# Altium project LimeSDR-X3_1v0.PrjPcb (part 18 of 19)

## Sheet 31_Power2.SchDoc: Board power supply 2
size A3; Organization: Lime Microsystems; Address1: Surrey Tech Centre; Address2: Guildford GU2 7YG; Address3: Surrey; Address4: United Kingdom; Revision: v1.0; SheetNumber: 31; SheetTotal: 31
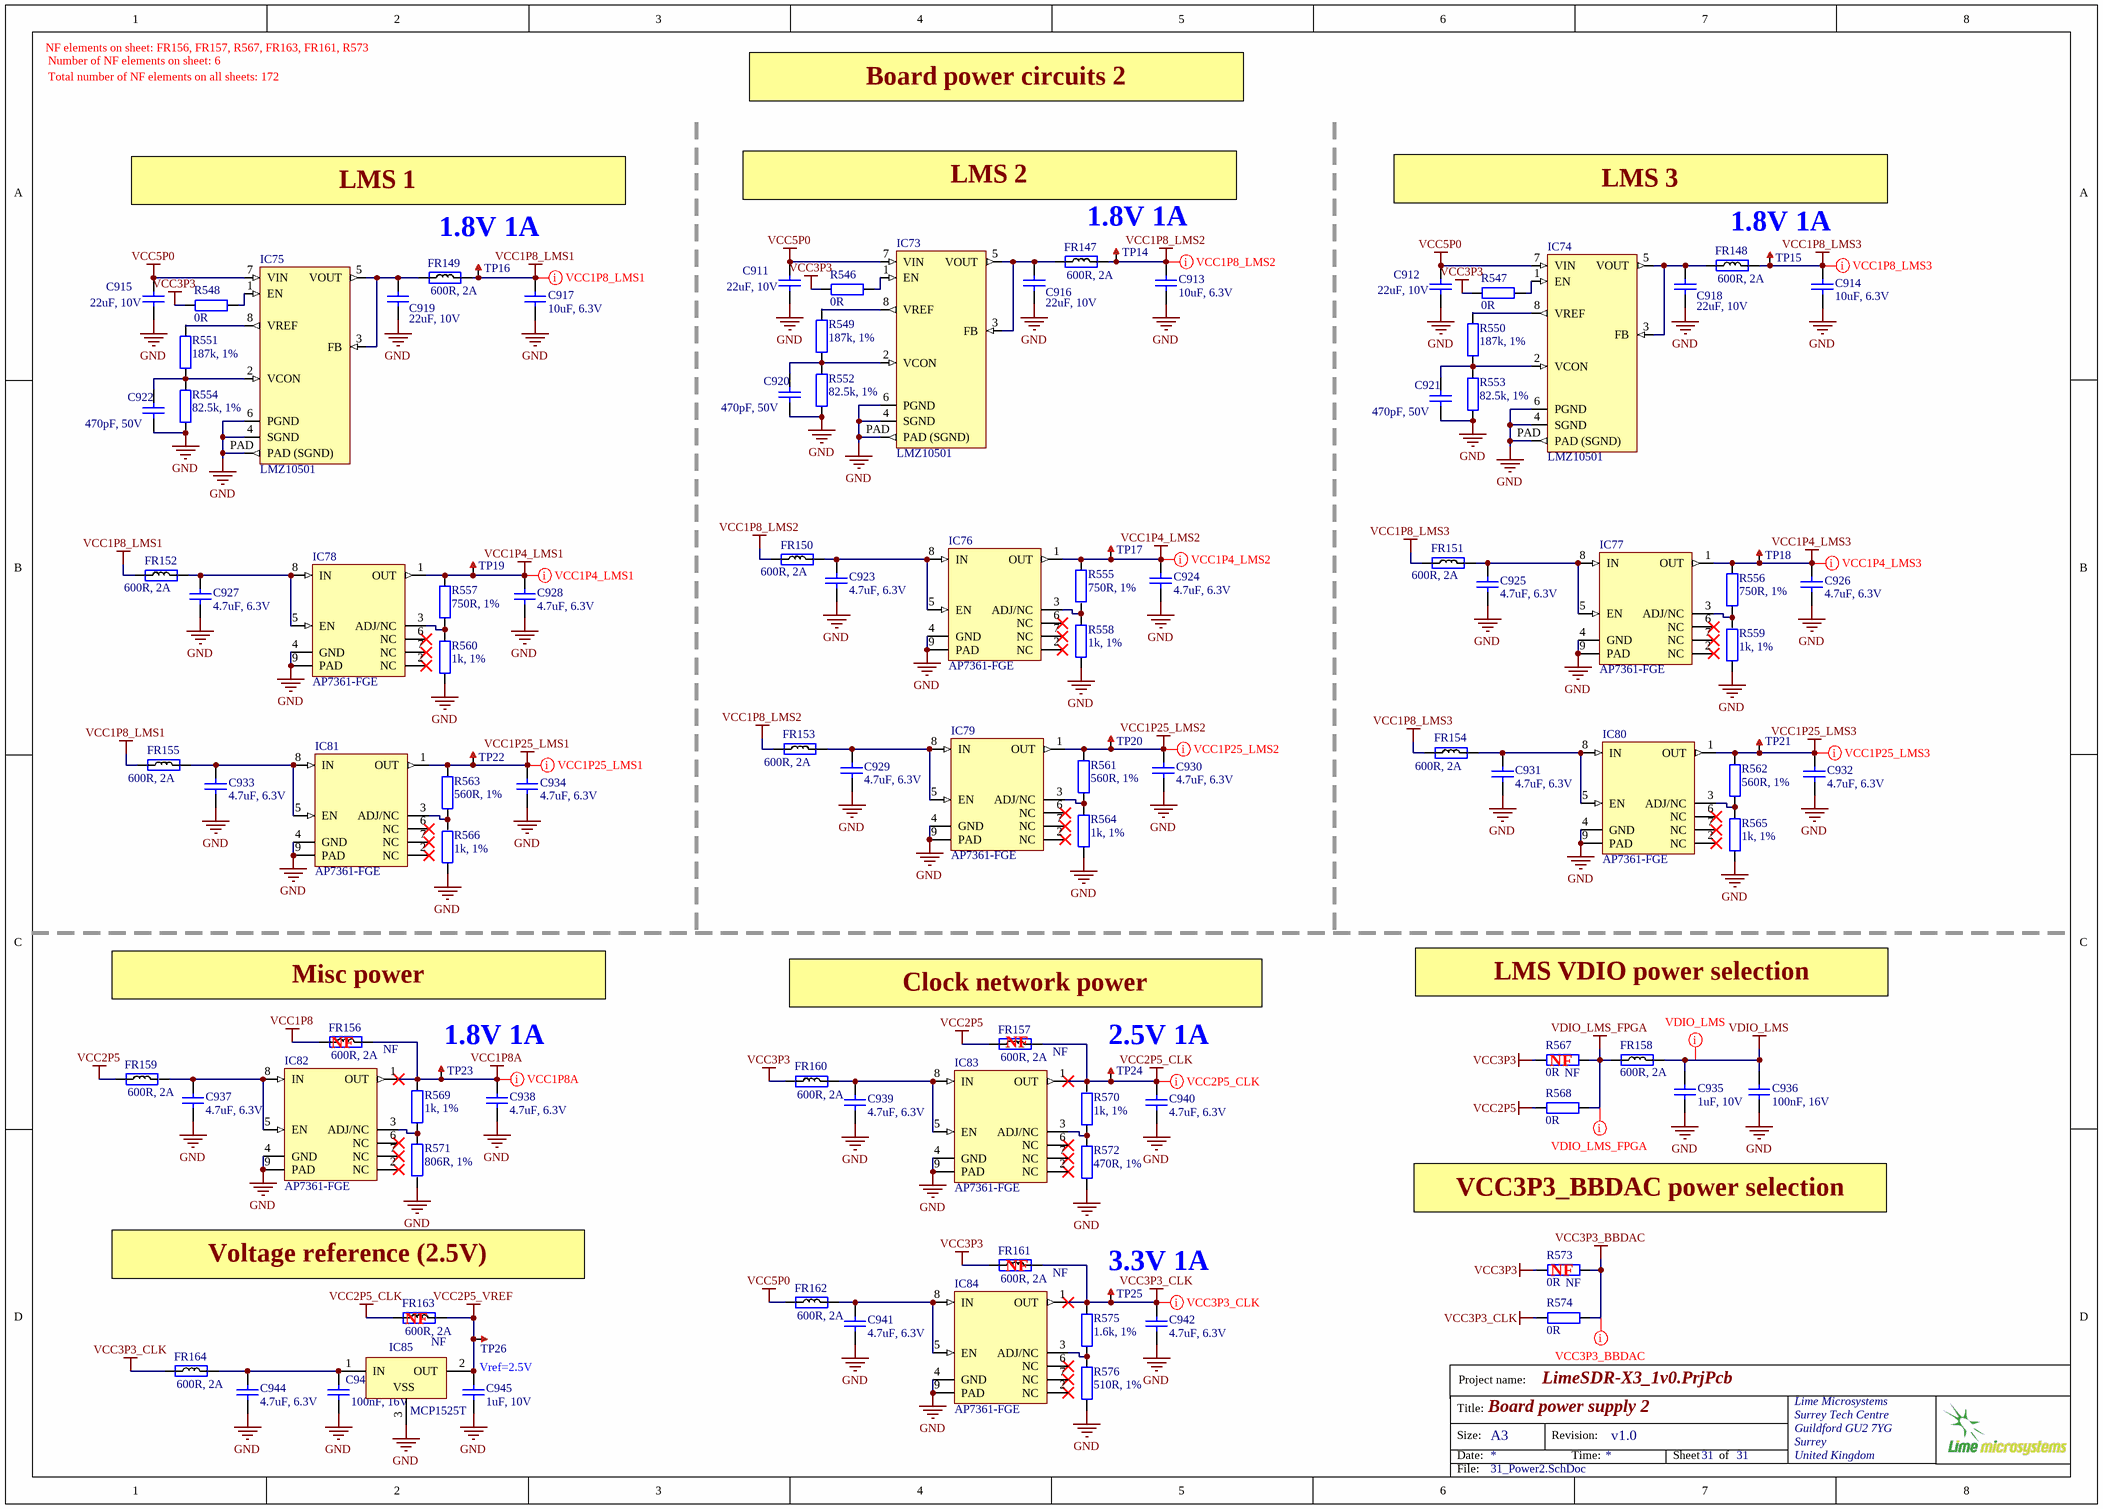
[diagram p30: 31_Power2.SchDoc]

### Parts
C911  22uF, 10V  [CAP0603]
C912  22uF, 10V  [CAP0603]
C913  10uF, 6.3V  [CAP0603]
C914  10uF, 6.3V  [CAP0603]
C915  22uF, 10V  [CAP0603]
C916  22uF, 10V  [CAP0603]
C917  10uF, 6.3V  [CAP0603]
C918  22uF, 10V  [CAP0603]
C919  22uF, 10V  [CAP0603]
C920  470pF, 50V  [CAP0402]
C921  470pF, 50V  [CAP0402]
C922  470pF, 50V  [CAP0402]
C923  4.7uF, 6.3V  [CAP0402]
C924  4.7uF, 6.3V  [CAP0402]
C925  4.7uF, 6.3V  [CAP0402]
C926  4.7uF, 6.3V  [CAP0402]
C927  4.7uF, 6.3V  [CAP0402]
C928  4.7uF, 6.3V  [CAP0402]
C929  4.7uF, 6.3V  [CAP0402]
C930  4.7uF, 6.3V  [CAP0402]
C931  4.7uF, 6.3V  [CAP0402]
C932  4.7uF, 6.3V  [CAP0402]
C933  4.7uF, 6.3V  [CAP0402]
C934  4.7uF, 6.3V  [CAP0402]
C935  1uF, 10V  [CAP0402]
C936  100nF, 16V  [CAP0402]
C937  4.7uF, 6.3V  [CAP0402]
C938  4.7uF, 6.3V  [CAP0402]
C939  4.7uF, 6.3V  [CAP0402]
C940  4.7uF, 6.3V  [CAP0402]
C941  4.7uF, 6.3V  [CAP0402]
C942  4.7uF, 6.3V  [CAP0402]
C943  100nF, 16V  [CAP0402]
C944  4.7uF, 6.3V  [CAP0402]
C945  1uF, 10V  [CAP0402]
FR147  600R, 2A  [RES0805]
FR148  600R, 2A  [RES0805]
FR149  600R, 2A  [RES0805]
FR150  600R, 2A  [RES0805]
FR151  600R, 2A  [RES0805]
FR152  600R, 2A  [RES0805]
FR153  600R, 2A  [RES0805]
FR154  600R, 2A  [RES0805]
FR155  600R, 2A  [RES0805]
FR156  600R, 2A  Assembly Info: NF  [RES0805]
FR157  600R, 2A  Assembly Info: NF  [RES0805]
FR158  600R, 2A  [RES0805]
FR159  600R, 2A  [RES0805]
FR160  600R, 2A  [RES0805]
FR161  600R, 2A  Assembly Info: NF  [RES0805]
FR162  600R, 2A  [RES0805]
FR163  600R, 2A  Assembly Info: NF  [RES0805]
FR164  600R, 2A  [RES0805]
IC73  LMZ10501  [LMZ10501]
IC74  LMZ10501  [LMZ10501]
IC75  LMZ10501  [LMZ10501]
IC76  AP7361-FGE  [AP7361]
IC77  AP7361-FGE  [AP7361]
IC78  AP7361-FGE  [AP7361]
IC79  AP7361-FGE  [AP7361]
IC80  AP7361-FGE  [AP7361]
IC81  AP7361-FGE  [AP7361]
IC82  AP7361-FGE  [AP7361]
IC83  AP7361-FGE  [AP7361]
IC84  AP7361-FGE  [AP7361]
IC85  MCP1525T  [SOT23-3_v2]
R546  0R  [RES0402]
R547  0R  [RES0402]
R548  0R  [RES0402]
R549  187k, 1%  [RES0402]
R550  187k, 1%  [RES0402]
R551  187k, 1%  [RES0402]
R552  82.5k, 1%  [RES0402]
R553  82.5k, 1%  [RES0402]
R554  82.5k, 1%  [RES0402]
R555  750R, 1%  [RES0402]
R556  750R, 1%  [RES0402]
R557  750R, 1%  [RES0402]
R558  1k, 1%  [RES0402]
R559  1k, 1%  [RES0402]
R560  1k, 1%  [RES0402]
R561  560R, 1%  [RES0402]
R562  560R, 1%  [RES0402]
R563  560R, 1%  [RES0402]
R564  1k, 1%  [RES0402]
R565  1k, 1%  [RES0402]
R566  1k, 1%  [RES0402]
R567  0R  Assembly Info: NF  [RES0402]
R568  0R  [RES0402]
R569  1k, 1%  [RES0402]
R570  1k, 1%  [RES0402]
R571  806R, 1%  [RES0402]
R572  470R, 1%  [RES0402]
R573  0R  Assembly Info: NF  [RES0402]
R574  0R  [RES0402]
R575  1.6k, 1%  [RES0402]
R576  510R, 1%  [RES0402]
TP14  TESTPOINT_PAD  [TP_PAD_1p5MM]  (value not drawn)  (no BOM)
TP15  TESTPOINT_PAD  [TP_PAD_1p5MM]  (value not drawn)  (no BOM)
TP16  TESTPOINT_PAD  [TP_PAD_1p5MM]  (value not drawn)  (no BOM)
TP17  TESTPOINT_PAD  [TP_PAD_1p5MM]  (value not drawn)  (no BOM)
TP18  TESTPOINT_PAD  [TP_PAD_1p5MM]  (value not drawn)  (no BOM)
TP19  TESTPOINT_PAD  [TP_PAD_1p5MM]  (value not drawn)  (no BOM)
TP20  TESTPOINT_PAD  [TP_PAD_1p5MM]  (value not drawn)  (no BOM)
TP21  TESTPOINT_PAD  [TP_PAD_1p5MM]  (value not drawn)  (no BOM)
TP22  TESTPOINT_PAD  [TP_PAD_1p5MM]  (value not drawn)  (no BOM)
TP23  TESTPOINT_PAD  [TP_PAD_1p5MM]  (value not drawn)  (no BOM)
TP24  TESTPOINT_PAD  [TP_PAD_1p5MM]  (value not drawn)  (no BOM)
TP25  TESTPOINT_PAD  [TP_PAD_1p5MM]  (value not drawn)  (no BOM)
TP26  TESTPOINT_PAD  [TP_PAD_1p5MM]  (value not drawn)  (no BOM)

### Nets
GND: C911.1 C912.1 C913.1 C914.1 C915.1 C916.1 C917.1 C918.1 C919.1 C920.2 C921.2 C922.2 C923.1 C924.1 C925.1 C926.1 C927.1 C928.1 C929.1 C930.1 C931.1 C932.1 C933.1 C934.1 C935.1 C936.2 C937.1 C938.1 C939.1 C940.1 C941.1 C942.1 C943.1 C944.1 C945.1 IC73.4(SGND) IC73.6(PGND) IC73.PAD(PAD_(SGND)) IC74.4(SGND) IC74.6(PGND) IC74.PAD(PAD_(SGND)) IC75.4(SGND) IC75.6(PGND) IC75.PAD(PAD_(SGND)) IC76.4(GND) IC76.9(PAD) IC77.4(GND) IC77.9(PAD) IC78.4(GND) IC78.9(PAD) IC79.4(GND) IC79.9(PAD) IC80.4(GND) IC80.9(PAD) IC81.4(GND) IC81.9(PAD) IC82.4(GND) IC82.9(PAD) IC83.4(GND) IC83.9(PAD) IC84.4(GND) IC84.9(PAD) IC85.3(VSS) R552.1 R553.1 R554.1 R558.1 R559.1 R560.1 R564.1 R565.1 R566.1 R571.2 R572.2 R576.2
VCC1P4_LMS1: C928.2 IC78.1(OUT) R557.1 TP19.1
VCC1P4_LMS2: C924.2 IC76.1(OUT) R555.1 TP17.1
VCC1P4_LMS3: C926.2 IC77.1(OUT) R556.1 TP18.1
VCC1P8: FR156.1
VCC1P8_LMS1: C917.2 FR149.2 FR152.1 FR155.1 TP16.1
VCC1P8_LMS2: C913.2 FR147.2 FR150.1 FR153.1 TP14.1
VCC1P8_LMS3: C914.2 FR148.2 FR151.1 FR154.1 TP15.1
VCC1P8A: C938.2 FR156.2 IC82.1(OUT) R569.2 TP23.1
VCC1P25_LMS1: C934.2 IC81.1(OUT) R563.2 TP22.1
VCC1P25_LMS2: C930.2 IC79.1(OUT) R561.2 TP20.1
VCC1P25_LMS3: C932.2 IC80.1(OUT) R562.2 TP21.1
VCC2P5: FR157.1 FR159.1 R568.2
VCC2P5_CLK: C940.2 FR157.2 FR163.1 IC83.1(OUT) R570.2 TP24.1
VCC2P5_VREF: C945.2 FR163.2 IC85.2(OUT) TP26.1
VCC3P3: FR160.1 FR161.1 R546.1 R547.1 R548.1 R567.2 R573.2
VCC3P3_BBDAC: R573.1 R574.1
VCC3P3_CLK: C942.2 FR161.2 FR164.1 IC84.1(OUT) R574.2 R575.2 TP25.1
VCC5P0: C911.2 C912.2 C915.2 FR162.1 IC73.7(VIN) IC74.7(VIN) IC75.7(VIN)
VDIO_LMS: C935.2 C936.1 FR158.2
VDIO_LMS_FPGA: FR158.1 R567.1 R568.1
NetC916_2: C916.2 FR147.1 IC73.3(FB) IC73.5(VOUT)
NetC918_2: C918.2 FR148.1 IC74.3(FB) IC74.5(VOUT)
NetC919_2: C919.2 FR149.1 IC75.3(FB) IC75.5(VOUT)
NetC920_1: C920.1 IC73.2(VCON) R549.1 R552.2
NetC921_1: C921.1 IC74.2(VCON) R550.1 R553.2
NetC922_1: C922.1 IC75.2(VCON) R551.1 R554.2
NetC923_2: C923.2 FR150.2 IC76.5(EN) IC76.8(IN)
NetC925_2: C925.2 FR151.2 IC77.5(EN) IC77.8(IN)
NetC927_2: C927.2 FR152.2 IC78.5(EN) IC78.8(IN)
NetC929_2: C929.2 FR153.2 IC79.5(EN) IC79.8(IN)
NetC931_2: C931.2 FR154.2 IC80.5(EN) IC80.8(IN)
NetC933_2: C933.2 FR155.2 IC81.5(EN) IC81.8(IN)
NetC937_2: C937.2 FR159.2 IC82.5(EN) IC82.8(IN)
NetC939_2: C939.2 FR160.2 IC83.5(EN) IC83.8(IN)
NetC941_2: C941.2 FR162.2 IC84.5(EN) IC84.8(IN)
NetC943_2: C943.2 C944.2 FR164.2 IC85.1(IN)
NetIC73_1: IC73.1(EN) R546.2
NetIC73_8: IC73.8(VREF) R549.2
NetIC74_1: IC74.1(EN) R547.2
NetIC74_8: IC74.8(VREF) R550.2
NetIC75_1: IC75.1(EN) R548.2
NetIC75_8: IC75.8(VREF) R551.2
NetIC76_3: IC76.3(ADJ/NC) R555.2 R558.2
NetIC77_3: IC77.3(ADJ/NC) R556.2 R559.2
NetIC78_3: IC78.3(ADJ/NC) R557.2 R560.2
NetIC79_3: IC79.3(ADJ/NC) R561.1 R564.2
NetIC80_3: IC80.3(ADJ/NC) R562.1 R565.2
NetIC81_3: IC81.3(ADJ/NC) R563.1 R566.2
NetIC82_3: IC82.3(ADJ/NC) R569.1 R571.1
NetIC83_3: IC83.3(ADJ/NC) R570.1 R572.1
NetIC84_3: IC84.3(ADJ/NC) R575.1 R576.1

Not connected (* = marked no-connect by the designer): IC76 2(NC)* 6(NC)* 7(NC)*; IC77 2(NC)* 6(NC)* 7(NC)*; IC78 2(NC)* 6(NC)* 7(NC)*; IC79 2(NC)* 6(NC)* 7(NC)*; IC80 2(NC)* 6(NC)* 7(NC)*; IC81 2(NC)* 6(NC)* 7(NC)*; IC82 2(NC)* 6(NC)* 7(NC)*; IC83 2(NC)* 6(NC)* 7(NC)*; IC84 2(NC)* 6(NC)* 7(NC)*

### Layout directives
net class VCC1P8_LMS1: VCC1P8_LMS1
net class VCC1P4_LMS1: VCC1P4_LMS1
net class VCC1P25_LMS1: VCC1P25_LMS1
net class VCC1P8_LMS2: VCC1P8_LMS2
net class VCC1P4_LMS2: VCC1P4_LMS2
net class VCC1P25_LMS2: VCC1P25_LMS2
net class VDIO_LMS: VDIO_LMS
net class VDIO_LMS_FPGA: VDIO_LMS_FPGA
net class VCC1P8_LMS3: VCC1P8_LMS3
net class VCC1P4_LMS3: VCC1P4_LMS3
net class VCC1P25_LMS3: VCC1P25_LMS3
net class VCC1P8A: VCC1P8A
net class VCC3P3_CLK: VCC3P3_CLK
net class VCC2P5_CLK: VCC2P5_CLK
net class VCC3P3_BBDAC: VCC3P3_BBDAC

### Notes on the sheet
- NF elements on sheet: FR156, FR157, R567, FR163, FR161, R573
- Number of NF elements on sheet: 6
- Total number of NF elements on all sheets: 172
- Board power circuits 2
- LMS 1
- 1.8V 1A
- LMS 2
- (near TP14) 1.8V 1A
- LMS 3
- (near TP15) 1.8V 1A
- LMS VDIO power selection
- Misc power
- (near FR156) NF
- (near TP23) 1.8V 1A
- (near FR157) Clock network power
- (near FR157) NF
- (near TP24) 2.5V 1A
- (near R567) NF
- VCC3P3_BBDAC power selection
- Voltage reference (2.5V)
- (near FR163) NF
- (near FR161) NF
- (near TP25) 3.3V 1A
- (near R573) NF
- (near C945) Vref=2.5V
- Project name:
- Title:
- Size:
- Date:
- A3
- Revision:
- Time:
- Sheet
- of
- File:

### Library data of the parts
C911 C912 C915 C916 C918 C919 = Cap_0603: Manufacturer Part Number 1: C1608X5R1A226M080AC; Manufacturer: TDK Corporation; Part Description: 22µF ±20% 10V Ceramic Capacitor X5R 0603 (1608 Metric); Brand: TDK; Temperature Coefficient / Code: +/- 15 %; Tolerance: 20 %; Type: Multilayer Ceramic Chip Capacitor; Supplier 1: Mouser; Supplier Part Number 1: 810-C1608X5R1A226M; Package / Case: 0603 (1608 metric); Category: Multilayer Ceramic Capacitors MLCC - SMD/SMT; Capacitance: 22 uF; Operating Temperature Range: - 55 C to + 85 C; Case Code - in: 0603; Voltage Rating DC: 10 V; Case Code - mm: 1608; Value: 22uF, 10V
C913 C914 C917 = Cap_0603: as C803 on sheet 29_Clocks2; Supplier 1: Digi-Key; Supplier Part Number 1: 311-1448-2-ND; Package / Case: 0603 (1608 Metric); Category: Capacitors; Voltage - Rated: 6.3V; Value: 10uF, 6.3V
C920-C922 = Cap_0402: Manufacturer Part Number 1: C1005C0G1H471J050BA; Manufacturer: TDK Corporation; Part Description: 470pF ±5% 50V Ceramic Capacitor C0G, NP0 0402 (1005 Metric); Tolerance: ±5%; Temperature Coefficient: C0G, NP0; Value: 470pF, 50V; Supplier 1: Digi-Key; Supplier Part Number 1: 445-2656-6-ND; Ratings: -; Package / Case: 0402 (1005 Metric); Capacitance: 470pF; Packaging: Digi-Reel®; RoHS: RoHS Compliant; Lead Style: -; Thickness (Max): 0.022" (0.55mm); Size / Dimension: 0.039" L x 0.020" W (1.00mm x 0.50mm); Lead Spacing: -; Operating Temperature: -55°C ~ 125°C; Height - Seated (Max): -; Applications: General Purpose; Mounting Type: Surface Mount, MLCC; Voltage - Rated: 50V; Category: Capacitors; Features: -; Manufacturer Part Number: C1005C0G1H471J050BA
C923-C934 C939-C942 = Cap_0402: as C891 on sheet 30_Power1; Lead Style: -; Ratings: -; Height - Seated (Max): -; Thickness (Max): 0.022" (0.55mm); Voltage - Rated: 6.3V; Packaging: Cut Tape (CT); Lead Spacing: -; Category: Capacitors; Supplier Part Number 1: 490-5408-1-ND; Applications: General Purpose; Operating Temperature: -55°C ~ 85°C; Mounting Type: Surface Mount, MLCC; Features: Derating Recommended; RoHS: RoHS Compliant; Supplier 1: Digi-Key; Package / Case: 0402 (1005 Metric); Size / Dimension: 0.039" L x 0.020" W (1.00mm x 0.50mm); Value: 4.7uF, 6.3V
C935 = Cap_0402: as C804 on sheet 29_Clocks2; Value: 1uF, 10V; Supplier 1: Digi-Key; Supplier Part Number 1: 445-9066-1-ND; MSL: -; RoHS: YES
C936 C943 = Cap_0402: as C802 on sheet 29_Clocks2; Value: 100nF, 16V; Supplier 1: Mouser; Supplier Part Number 1: 81-GRM155R71C104KA88; Case Code - in: 0402; RoHS: RoHS Compliant; Operating Temperature Range: - 55 C to + 125 C; Series: GRM; Termination Style: SMD/SMT; Package / Case: 0402 (1005 metric); Voltage Rating DC: 16 V; Maximum Operating Temperature: + 125 C; Case Code - mm: 1005; Minimum Operating Temperature: - 55 C; Product Category: Low & Medium Capacitance SMD Ceramic Chip Capacitors; Packaging: Reel; Product: General Type MLCCs; Category: Multilayer Ceramic Capacitors MLCC - SMD/SMT; Brand: Murata Electronics; Case Width: 0.5 mm; RoHS - Mouser: Y; Standard Pack Qty: 10000; Minimum Order Quantity: 1; Reeling: True
C937 C938 = Cap_0402: Manufacturer Part Number 1: GRM155R60J475ME87D; Manufacturer: Murata Electronics North America; Part Description: 4.7µF ±20% 6.3V X5R Ceramic Capacitor -55°C ~ 85°C Surface Mount, MLCC 0402 (1005 Metric) 0.039" L x 0.020" W (1.00mm x 0.50mm); Temperature Coefficient: X5R; Capacitance: 4.7µF; Tolerance: ±20%; Value: 4.7uF, 6.3V; Supplier 1: Digi-Key; Supplier Part Number 1: 490-5408-1-ND; Category: Capacitors; Voltage - Rated: 6.3V; Thickness (Max): 0.022" (0.55mm); Applications: General Purpose; Package / Case: 0402 (1005 Metric); Size / Dimension: 0.039" L x 0.020" W (1.00mm x 0.50mm); Features: Derating Recommended; Mounting Type: Surface Mount, MLCC; Ratings: -; Lead Style: -; Operating Temperature: -55°C ~ 85°C; Lead Spacing: -; RoHS: RoHS Compliant; Height - Seated (Max): -; Packaging: Cut Tape (CT)
C944 = Cap_0402: Manufacturer: Murata Electronics North America; Part Description: 4.7µF ±20% 6.3V X5R Ceramic Capacitor -55°C ~ 85°C Surface Mount, MLCC 0402 (1005 Metric) 0.039" L x 0.020" W (1.00mm x 0.50mm); Manufacturer Part Number 1: GRM155R60J475ME87D; Tolerance: ±20%; Capacitance: 4.7µF; Temperature Coefficient: X5R; Lead Style: -; Ratings: -; Height - Seated (Max): -; Thickness (Max): 0.022" (0.55mm); Voltage - Rated: 6.3V; Packaging: Cut Tape (CT); Lead Spacing: -; Category: Capacitors; Supplier Part Number 1: 490-5408-1-ND; Applications: General Purpose; Operating Temperature: -55°C ~ 85°C; Mounting Type: Surface Mount, MLCC; Features: Derating Recommended; RoHS: RoHS Compliant; Supplier 1: Digi-Key; Package / Case: 0402 (1005 Metric); Size / Dimension: 0.039" L x 0.020" W (1.00mm x 0.50mm); Value: 4.7uF, 6.3V
C945 = Cap_0402: Manufacturer Part Number 1: C1005X5R1E105K050BC; Manufacturer: TDK; Part Description: 1µF ±10% 10V X5R Ceramic Capacitor -55°C ~ 85°C Surface Mount, MLCC 0402 (1005 Metric) 0.039" L x 0.020" W (1.00mm x 0.50mm); Voltage Rating: 10; Capacitance: 1; Capacitance Tolerance: ± 10%; Ceramic Capacitor Case: 0402 [1005 Metric]; Dielectric Characteristic: X6; Product Range: TDK - C Series; Value: 1uF, 10V; Supplier 1: Digi-Key; Supplier Part Number 1: 445-9066-1-ND; MSL: -; RoHS: YES
FR147-FR164 = Ferrite: as FR139 on sheet 29_Clocks2; Supplier 1: Digi-Key; Supplier Part Number 1: 445-2206-2-ND; Mounting Type: Surface Mount; RoHS: RoHS Compliant; Height (Max): 0.041" (1.05mm); Packaging: Tape & Reel (TR); Category: Filters; Current Rating: 2A; Package / Case: 0805 (2012 Metric); Size / Dimension: 0.079" L x 0.049" W (2.00mm x 1.25mm); Value: 600R, 2A
IC73-IC75 = LMZ10501: Manufacturer: Texas Instruments; Manufacturer Part Number 1: LMZ10501SILR; Part Description: n  Non-Isolated PoL Module DC DC Converter 1 Output 0.6 ~ 3.6 V 1A 2.7V - 5.5V Input; Voltage - Input (Min): 2.7V; Voltage - Input (Max): 5.5V; Voltage - Output 1: 0.6 ~ 3.6 V; Current - Output (Max): 1A; Efficiency: 95%; Supplier 1: Digi-Key; RoHS: RoHS Compliant; Category: Power Supplies - Board Mount; Stock 1: 26559; Pricing 1: 1=2.46, 5=2.424, 10=2.388, 25=2.318, 50=2.2478, 100=2.1776, 250=2.1074, 500=1.96688 (USD); Packaging: Cut Tape (CT); Part Status: Active; Type: Non-Isolated PoL Module; Voltage - Output 2: -; Voltage - Output 3: -; Applications: ITE (Commercial); Features: OCP, OTP, UVLO; Operating Temperature: -40°C ~ 125°C; Mounting Type: Surface Mount; Package / Case: 8-LDFN Exposed Pad, Module; Size / Dimension: 0.12" L x 0.10" W x 0.03" H (3.0mm x 2.5mm x 0.7mm); Supplier Device Package: 8-uSIP; ComponentLink1URL: http://www.ti.com/lit/ds/symlink/lmz10501.pdf; ComponentLink1Description: http://www.ti.com/lit/ds/symlink/lmz10501.pdf; Supplier Part Number 1: 296-37104-1-ND
IC76-IC81 IC83 IC84 = AP7361: Manufacturer Part Number 1: AP7361-FGE-7; Manufacturer: Diodes Incorporated; Part Description: IC REG LDO ADJ 1A 8DFN; Regulator Topology: Positive Adjustable; Current - Output: 1A; Current - Limit (Min): 1.1A; Voltage - Dropout (Typical): 0.5V @ 1A; Voltage - Output: 0.8 V ~ 5.5 V; Number of Regulators: 1; Voltage - Input: 2.2 V ~ 6 V; Supplier 1: Digi-Key; Supplier Part Number 1: AP7361-FGE-7DICT-ND; RoHS: RoHS Compliant; Supplier Device Package: U-DFN3030-8; Mounting Type: Surface Mount; Category: Integrated Circuits (ICs); Packaging: Cut Tape (CT); Package / Case: 8-UDFN Exposed Pad; Operating Temperature: -40°C ~ 85°C
IC82 = AP7361: Manufacturer: Diodes Incorporated; Part Description: IC REG LDO ADJ 1A 8DFN; Manufacturer Part Number 1: AP7361-FGE-7; Regulator Topology: Positive Adjustable; Current - Output: 1A; Current - Limit (Min): 1.1A; Voltage - Dropout (Typical): 0.5V @ 1A; Voltage - Output: 0.8 V ~ 5.5 V; Number of Regulators: 1; Voltage - Input: 2.2 V ~ 6 V; Supplier 1: Digi-Key; Supplier Part Number 1: AP7361-FGE-7DICT-ND; RoHS: RoHS Compliant; Supplier Device Package: U-DFN3030-8; Mounting Type: Surface Mount; Category: Integrated Circuits (ICs); Packaging: Cut Tape (CT); Package / Case: 8-UDFN Exposed Pad; Operating Temperature: -40°C ~ 85°C
IC85 = MCP1525T-I/TT: 2.5V Voltage Reference, 3-Pin SOT-23, Industrial Temperature, Tape and Reel; Manufacturer: Microchip Technology; Part Description: Series Voltage Reference IC ±1% 2mA SOT-23-3; Reference Type: Series; Output Type: Fixed; Current - Output: 2mA; Tolerance: ±1%; Temperature Coefficient: 50ppm/°C; Noise - 0.1Hz to 10Hz: 90µVp-p; Noise - 10Hz to 10kHz: 500µVrms; Voltage - Input: 2.7 V ~ 5.5 V; Current - Supply: 120µA; PackageDescription: Series Voltage Reference IC ±1% 2mA SOT-23-3; Supplier 1: Digi-Key; Manufacturer Part Number 1: MCP1525T-I/TT; RoHS: RoHS Compliant; Category: Integrated Circuits (ICs); Stock 1: 16612; Pricing 1: 1=0.77, 25=0.64, 100=0.58 (USD); Packaging: Digi-Reel®; Part Status: Active; Voltage - Output (Min/Fixed): 2.5V; Voltage - Output (Max): -; Current - Cathode: -; Operating Temperature: -40°C ~ 85°C (TA); Mounting Type: Surface Mount; Package / Case: TO-236-3, SC-59, SOT-23-3; Supplier Device Package: SOT-23-3; ComponentLink1URL: http://www.microchip.com/mymicrochip/filehandler.aspx?ddocname=en011331; ComponentLink1Description: http://www.microchip.com/mymicrochip/filehandler.aspx?ddocname=en011331; Supplier Part Number 1: MCP1525T-I/TTDKR-ND
R546-R548 R567 R568 R573 R574 = Res_0402: as R463-R466 on sheet 29_Clocks2; Value: 0R; Supplier 1: Digi-Key; Supplier Part Number 1: 311-0.0JRTR-ND; Category: Resistors; Temperature Coefficient: -; Features: Moisture Resistant; Supplier Device Package: 0402; Height: 0.016" (0.40mm); Package / Case: 0402 (1005 Metric); Operating Temperature: -55°C ~ 155°C; Size / Dimension: 0.039" L x 0.020" W (1.00mm x 0.50mm); Composition: Thick Film; Packaging: Tape & Reel (TR); Number of Terminations: 2; RoHS: RoHS Compliant
R549-R551 = Res_0402: Manufacturer Part Number 1: RC0402FR-07187KL; Manufacturer: Yageo; Part Description: 187 kOhms ±1% 0.063W, 1/16W Chip Resistor 0402 (1005 Metric) Moisture Resistant Thick Film; Power (Watts): 0.063W, 1/16W; Temperature Coefficient: ±100ppm/°C; Value: 187k, 1%; Tolerance: ±1%; Height - Seated (Max): 0.016" (0.40mm); Package / Case: 0402 (1005 Metric); Supplier Device Package: 0402; Size / Dimension: 0.039" L x 0.020" W (1.00mm x 0.50mm); Category: Resistors; Composition: Thick Film; Features: Moisture Resistant; Supplier Part Number 1: 311-187KLRCT-ND; RoHS: RoHS Compliant; Part Status: Active; Supplier 1: Digi-Key; Packaging: Cut Tape (CT); Operating Temperature: -55°C ~ 155°C; Failure Rate: -
R552-R554 = Res_0402: Manufacturer: Yageo; Manufacturer Part Number 1: RC0402FR-0782K5L; Part Description: 82.5 kOhms ±1% 0.063W, 1/16W Chip Resistor 0402 (1005 Metric) Moisture Resistant Thick Film; Power (Watts): 0.063W, 1/16W; Temperature Coefficient: ±100ppm/°C; Value: 82.5k, 1%; RoHS: RoHS Compliant; Operating Temperature: -55°C ~ 155°C; Packaging: Cut Tape (CT); Category: Resistors; Failure Rate: -; Supplier Part Number 1: 311-82.5KLRCT-ND; Part Status: Active; Tolerance: ±1%; Features: Moisture Resistant; Supplier Device Package: 0402; Height - Seated (Max): 0.016" (0.40mm); Supplier 1: Digi-Key; Composition: Thick Film; Size / Dimension: 0.039" L x 0.020" W (1.00mm x 0.50mm); Package / Case: 0402 (1005 Metric)
R555-R557 = Res_0402: Manufacturer Part Number 1: RC0402FR-07750RL; Manufacturer: Yageo; Part Description: RES SMD 750 OHM 1% 1/16W 0402; Resistance (Ohms): 750; Power (Watts): 0.063W, 1/16W; Temperature Coefficient: ±100ppm/°C; Value: 750R, 1%; Tolerance: ±1%; Number of Terminations: 2; Supplier Device Package: 0402; Size / Dimension: 0.039" L x 0.020" W (1.00mm x 0.50mm); Height: 0.016" (0.40mm); Composition: Thick Film; Features: Moisture Resistant; Operating Temperature: -55°C ~ 155°C; Package / Case: 0402 (1005 Metric); Supplier 1: Digi-Key; RoHS: RoHS Compliant; Category: Resistors; Packaging: Cut Tape (CT); Supplier Part Number 1: 311-750LRCT-ND
R558-R560 R564-R566 R569 R570 = Res_0402: Manufacturer: Stackpole Electronics Inc; Manufacturer Part Number 1: RMCF0402FT1K00; Part Description: RES SMD 1K OHM 1% 1/16W 0402; Temperature Coefficient: ±100ppm/°C; Power (Watts): 0.063W, 1/16W; Value: 1k, 1%; Supplier 1: Digi-Key; Supplier Part Number 1: RMCF0402FT1K00TR-ND; Resistance (Ohms): 1k; Packaging: Tape & Reel (TR); Category: Resistors; RoHS: RoHS Compliant; Tolerance: ±1%; Height: 0.016" (0.40mm); Number of Terminations: 2; Package / Case: 0402 (1005 Metric); Operating Temperature: -55°C ~ 155°C; Features: -; Composition: Thick Film; Supplier Device Package: 0402; Size / Dimension: 0.039" L x 0.020" W (1.00mm x 0.50mm)
R561-R563 = Res_0402: Manufacturer Part Number 1: CRCW0402560RFKED; Manufacturer: Vishay Dale; Part Description: RES SMD 560 OHM 1% 1/16W 0402; Resistance (Ohms): 560; Power (Watts): 0.063W, 1/16W; Temperature Coefficient: ±100ppm/°C; RoHS: RoHS Compliant; Packaging: Cut Tape (CT); Composition: Thick Film; Tolerance: ±1%; Number of Terminations: 2; Supplier Device Package: 0402 (1005 Metric); Operating Temperature: -55°C ~ 155°C; Features: Automotive AEC-Q200; Category: Resistors; Supplier Part Number 1: 541-560LCT-ND; Package / Case: 0402 (1005 Metric); Supplier 1: Digi-Key; Height: 0.016" (0.40mm); Size / Dimension: 0.039" L x 0.020" W (1.00mm x 0.50mm)
R571 = Res_0402: Manufacturer Part Number 1: RMCF0402FT806R; Manufacturer: Stackpole Electronics Inc; Part Description: RMCF0402FT806RCT-ND; Resistance (Ohms): 806; Power (Watts): 0.063W, 1/16W; Temperature Coefficient: ±100ppm/°C; Value: 806R, 1%; Supplier 1: Digi-Key; Supplier Part Number 1: RMCF0402FT806RCT-ND; Category: Resistors; Size / Dimension: 0.039" L x 0.020" W (1.00mm x 0.50mm); Tolerance: ±1%; Features: -; Number of Terminations: 2; RoHS: RoHS Compliant; Operating Temperature: -55°C ~ 155°C; Packaging: Cut Tape (CT); Package / Case: 0402 (1005 Metric); Composition: Thick Film; Height: 0.016" (0.40mm); Supplier Device Package: 0402
R572 = Res_0402: Manufacturer: Yageo; Manufacturer Part Number 1: RC0402FR-07470RL; Part Description: 470 Ohms ±1% 0.063W, 1/16W Chip Resistor 0402 (1005 Metric) Moisture Resistant Thick Film; Power Rating: 62.5mW; Temperature Coefficient: 100ppm/°C; Voltage Rating: 50V; Max Power Dissipation: 63mW; Value: 470R, 1%; Supplier 1: Digi-Key; Supplier Part Number 1: 311-470LRCT-ND; Stock 1: 1652476; Pricing 1: 1=0,10000, 10=0,01600, 100=0,00660, 1000=0,00299, 2500=0,00259, 5000=0,00214 (USD); RoHS: Yes; Case/Package: 0402; Case Code (Metric): 1005; Case Code (Imperial): 0402; Size Code: 0402; Min Operating Temperature: -55°C; Max Operating Temperature: 155°C; Packaging: Tape and Reel; Tolerance: 1%; Resistance: 470R; Number of Terminations: 2; Features: Moisture Resistant; Package Quantity: 1; Resistor Type: Thick Film; Termination: SMD/SMT; Series: RC; Resistance Tolerance: 1%; Construction: Rectangular; Length: 1mm; Width: 0.02inch; Height: 0.016inch; Depth: 0.5mm; Lead Free: Lead Free; REACH SVHC: Unknown; Military Standard: Not; RoHS Compliant: Yes
R575 = Res_0402: Manufacturer Part Number 1: RC0402FR-071K6L; Manufacturer: Yageo; Part Description: 1.6 kOhms ±1% 0.063W, 1/16W Chip Resistor 0402 (1005 Metric) Moisture Resistant Thick Film; Temperature Coefficient: ±100ppm/°C; Power (Watts): 0.063W, 1/16W; Value: 1.6k, 1%; Tolerance: ±1%; RoHS: RoHS Compliant; Package / Case: 0402 (1005 Metric); Height - Seated (Max): 0.016" (0.40mm); Supplier Device Package: 0402; Failure Rate: -; Composition: Thick Film; Part Status: Active; Size / Dimension: 0.039" L x 0.020" W (1.00mm x 0.50mm); Operating Temperature: -55°C ~ 155°C; Packaging: Cut Tape (CT); Features: Moisture Resistant; Supplier Part Number 1: YAG3045CT-ND; Category: Resistors; Supplier 1: Digi-Key
R576 = Res_0402: Manufacturer Part Number 1: RC0402FR-07510RL; Manufacturer: Yageo; Part Description: 510 Ohms ±1% 0.063W, 1/16W Chip Resistor 0402 (1005 Metric) Moisture Resistant Thick Film; Temperature Coefficient: ±100ppm/°C; Power (Watts): 0.063W, 1/16W; Value: 510R, 1%; Operating Temperature: -55°C ~ 155°C; Part Status: Active; Tolerance: ±1%; Packaging: Cut Tape (CT); Features: Moisture Resistant; Composition: Thick Film; Supplier Device Package: 0402; Failure Rate: -; Package / Case: 0402 (1005 Metric); Height - Seated (Max): 0.016" (0.40mm); Size / Dimension: 0.039" L x 0.020" W (1.00mm x 0.50mm); Supplier 1: Digi-Key; RoHS: RoHS Compliant; Category: Resistors; Supplier Part Number 1: 311-510LRCT-ND
TP14-TP26 = TESTPOINT_PAD: Test Point PCB mount Miniature White